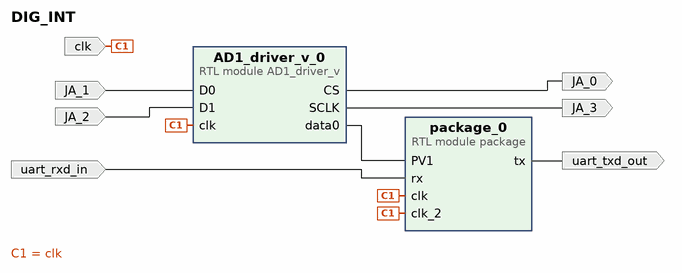
[diagram p0: block diagram of the top level]
# Vivado block design DIG_INT, Vivado 2016.1
create_bd_design DIG_INT

create_bd_port -dir I JA_1
create_bd_port -dir I JA_2
create_bd_port -dir I -type clk clk
create_bd_port -dir O JA_0
create_bd_port -dir O JA_3
create_bd_port -dir O uart_txd_out
create_bd_port -dir I uart_rxd_in

create_bd_cell -type module -reference AD1_driver_v AD1_driver_v_0
create_bd_cell -type module -reference package package_0

# ---- connections ----

connect_bd_net [get_bd_pins AD1_driver_v_0/data0] [get_bd_pins package_0/PV1]
connect_bd_net -net D0_1 [get_bd_ports JA_1] [get_bd_pins AD1_driver_v_0/D0]
connect_bd_net -net D1_1 [get_bd_ports JA_2] [get_bd_pins AD1_driver_v_0/D1]
connect_bd_net -net clk_1_1 [get_bd_ports clk] [get_bd_pins AD1_driver_v_0/clk] [get_bd_pins package_0/clk] [get_bd_pins package_0/clk_2]
connect_bd_net [get_bd_pins AD1_driver_v_0/CS] [get_bd_ports JA_0]
connect_bd_net [get_bd_pins AD1_driver_v_0/SCLK] [get_bd_ports JA_3]
connect_bd_net [get_bd_pins package_0/tx] [get_bd_ports uart_txd_out]
connect_bd_net -net rx_1 [get_bd_ports uart_rxd_in] [get_bd_pins package_0/rx]

validate_bd_design
save_bd_design
